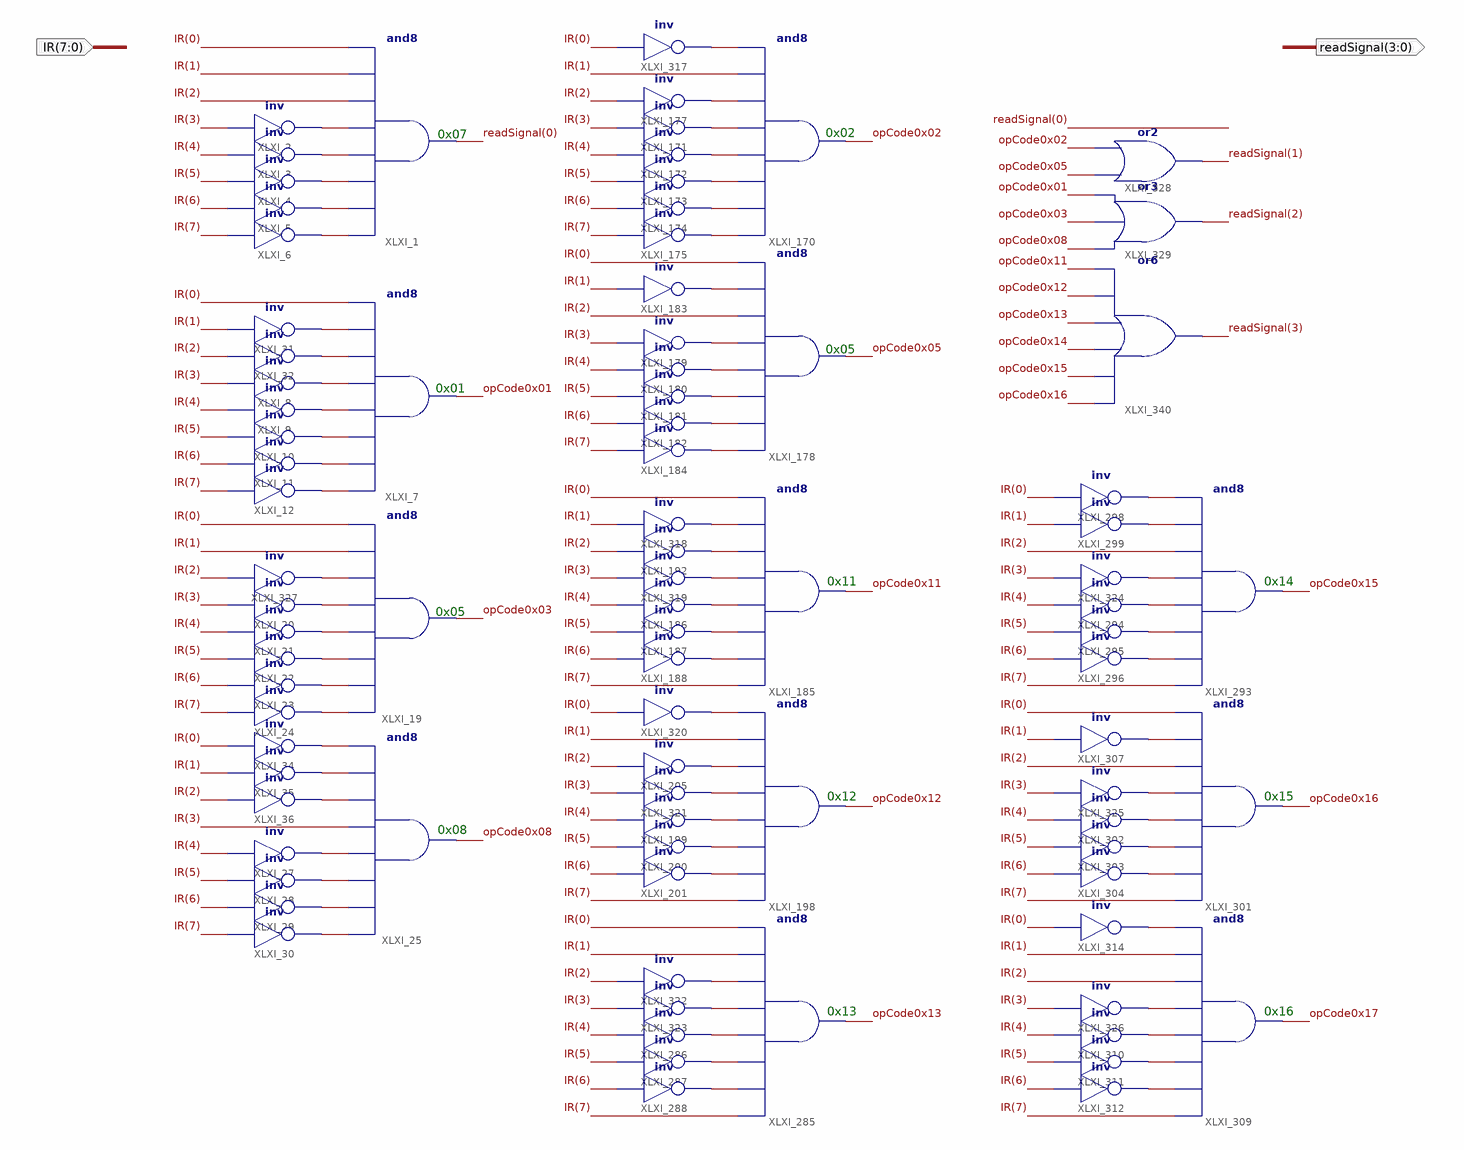
[diagram p0: schematic sheet 1]
// Xilinx ISE schematic CU_Read.sch (spartan3e) as structural Verilog: 86 symbols, 2 ports
module CU_Read (
  input  [7:0] IR,
  output [3:0] readSignal
);

  wire opCode0x01, opCode0x02, opCode0x03, opCode0x05, opCode0x08, opCode0x11, opCode0x12, opCode0x13,
       opCode0x14, opCode0x15, opCode0x16, opCode0x17, XLXN_4, XLXN_6, XLXN_8, XLXN_10, XLXN_12, XLXN_18,
       XLXN_20, XLXN_22, XLXN_24, XLXN_26, XLXN_44, XLXN_46, XLXN_48, XLXN_50, XLXN_52, XLXN_59, XLXN_61,
       XLXN_63, XLXN_65, XLXN_70, XLXN_72, XLXN_78, XLXN_80, XLXN_82, XLXN_343, XLXN_345, XLXN_347, XLXN_349,
       XLXN_351, XLXN_356, XLXN_358, XLXN_360, XLXN_362, XLXN_364, XLXN_366, XLXN_370, XLXN_373, XLXN_375,
       XLXN_377, XLXN_385, XLXN_398, XLXN_400, XLXN_402, XLXN_410, XLXN_562, XLXN_564, XLXN_566, XLXN_577,
       XLXN_579, XLXN_581, XLXN_585, XLXN_587, XLXN_592, XLXN_594, XLXN_596, XLXN_602, XLXN_607, XLXN_609,
       XLXN_611, XLXN_615, XLXN_627, XLXN_629, XLXN_631, XLXN_633, XLXN_635, XLXN_637, XLXN_639, XLXN_641,
       XLXN_643, XLXN_645, XLXN_653;

  and XLXI_7 (opCode0x01, XLXN_26, XLXN_24, XLXN_22, XLXN_20, XLXN_18, XLXN_72, XLXN_70, IR[0]);
  not XLXI_8 (XLXN_18, IR[3]);
  not XLXI_9 (XLXN_20, IR[4]);
  not XLXI_10 (XLXN_22, IR[5]);
  not XLXI_11 (XLXN_24, IR[6]);
  not XLXI_12 (XLXN_26, IR[7]);
  and XLXI_1 (readSignal[0], XLXN_12, XLXN_10, XLXN_8, XLXN_6, XLXN_4, IR[2], IR[1], IR[0]);
  not XLXI_2 (XLXN_4, IR[3]);
  not XLXI_3 (XLXN_6, IR[4]);
  not XLXI_4 (XLXN_8, IR[5]);
  not XLXI_5 (XLXN_10, IR[6]);
  not XLXI_6 (XLXN_12, IR[7]);
  not XLXI_31 (XLXN_70, IR[1]);
  not XLXI_32 (XLXN_72, IR[2]);
  and XLXI_170 (opCode0x02, XLXN_351, XLXN_349, XLXN_347, XLXN_345, XLXN_343, XLXN_356, IR[1], XLXN_627);
  not XLXI_171 (XLXN_343, IR[3]);
  not XLXI_172 (XLXN_345, IR[4]);
  not XLXI_173 (XLXN_347, IR[5]);
  not XLXI_174 (XLXN_349, IR[6]);
  not XLXI_175 (XLXN_351, IR[7]);
  not XLXI_177 (XLXN_356, IR[2]);
  and XLXI_178 (opCode0x05, XLXN_366, XLXN_364, XLXN_362, XLXN_360, XLXN_358, IR[2], XLXN_370, IR[0]);
  not XLXI_179 (XLXN_358, IR[3]);
  not XLXI_180 (XLXN_360, IR[4]);
  not XLXI_181 (XLXN_362, IR[5]);
  not XLXI_182 (XLXN_364, IR[6]);
  not XLXI_183 (XLXN_370, IR[1]);
  not XLXI_184 (XLXN_366, IR[7]);
  and XLXI_19 (opCode0x03, XLXN_52, XLXN_50, XLXN_48, XLXN_46, XLXN_44, XLXN_653, IR[1], IR[0]);
  not XLXI_20 (XLXN_44, IR[3]);
  not XLXI_21 (XLXN_46, IR[4]);
  not XLXI_22 (XLXN_48, IR[5]);
  not XLXI_23 (XLXN_50, IR[6]);
  not XLXI_24 (XLXN_52, IR[7]);
  and XLXI_25 (opCode0x08, XLXN_65, XLXN_63, XLXN_61, XLXN_59, IR[3], XLXN_82, XLXN_80, XLXN_78);
  not XLXI_27 (XLXN_59, IR[4]);
  not XLXI_28 (XLXN_61, IR[5]);
  not XLXI_29 (XLXN_63, IR[6]);
  not XLXI_30 (XLXN_65, IR[7]);
  not XLXI_34 (XLXN_78, IR[0]);
  not XLXI_35 (XLXN_80, IR[1]);
  not XLXI_36 (XLXN_82, IR[2]);
  and XLXI_185 (opCode0x11, IR[7], XLXN_377, XLXN_375, XLXN_373, XLXN_631, XLXN_385, XLXN_629, IR[0]);
  not XLXI_186 (XLXN_373, IR[4]);
  not XLXI_187 (XLXN_375, IR[5]);
  not XLXI_188 (XLXN_377, IR[6]);
  not XLXI_192 (XLXN_385, IR[2]);
  and XLXI_198 (opCode0x12, IR[7], XLXN_402, XLXN_400, XLXN_398, XLXN_635, XLXN_410, IR[1], XLXN_633);
  not XLXI_199 (XLXN_398, IR[4]);
  not XLXI_200 (XLXN_400, IR[5]);
  not XLXI_205 (XLXN_410, IR[2]);
  and XLXI_285 (opCode0x13, IR[7], XLXN_566, XLXN_564, XLXN_562, XLXN_639, XLXN_637, IR[1], IR[0]);
  not XLXI_286 (XLXN_562, IR[4]);
  not XLXI_287 (XLXN_564, IR[5]);
  not XLXI_288 (XLXN_566, IR[6]);
  and XLXI_293 (opCode0x15, IR[7], XLXN_581, XLXN_579, XLXN_577, XLXN_641, IR[2], XLXN_587, XLXN_585);
  not XLXI_294 (XLXN_577, IR[4]);
  not XLXI_295 (XLXN_579, IR[5]);
  not XLXI_296 (XLXN_581, IR[6]);
  not XLXI_298 (XLXN_585, IR[0]);
  not XLXI_299 (XLXN_587, IR[1]);
  and XLXI_301 (opCode0x16, IR[7], XLXN_596, XLXN_594, XLXN_592, XLXN_643, IR[2], XLXN_602, IR[0]);
  not XLXI_302 (XLXN_592, IR[4]);
  not XLXI_303 (XLXN_594, IR[5]);
  not XLXI_304 (XLXN_596, IR[6]);
  not XLXI_307 (XLXN_602, IR[1]);
  and XLXI_309 (opCode0x17, IR[7], XLXN_611, XLXN_609, XLXN_607, XLXN_645, IR[2], IR[1], XLXN_615);
  not XLXI_310 (XLXN_607, IR[4]);
  not XLXI_311 (XLXN_609, IR[5]);
  not XLXI_312 (XLXN_611, IR[6]);
  not XLXI_314 (XLXN_615, IR[0]);
  not XLXI_317 (XLXN_627, IR[0]);
  not XLXI_201 (XLXN_402, IR[6]);
  not XLXI_318 (XLXN_629, IR[1]);
  not XLXI_319 (XLXN_631, IR[3]);
  not XLXI_320 (XLXN_633, IR[0]);
  not XLXI_321 (XLXN_635, IR[3]);
  not XLXI_322 (XLXN_637, IR[2]);
  not XLXI_323 (XLXN_639, IR[3]);
  not XLXI_324 (XLXN_641, IR[3]);
  not XLXI_325 (XLXN_643, IR[3]);
  not XLXI_326 (XLXN_645, IR[3]);
  not XLXI_327 (XLXN_653, IR[2]);
  or XLXI_329 (readSignal[2], opCode0x08, opCode0x03, opCode0x01);
  or XLXI_340 (readSignal[3], opCode0x16, opCode0x15, opCode0x14, opCode0x13, opCode0x12, opCode0x11);
  or XLXI_328 (readSignal[1], opCode0x05, opCode0x02);

  // Notes on the sheet:
  //   0x02
  //   0x07
  //   0x05
  //   0x01
  //   0x11
  //   0x14
  //   0x05
  //   0x12
  //   0x15
  //   0x08
  //   0x13
  //   0x16
endmodule
